# Altium schematic sheet adapter.SchDoc
size A3; SheetNumber: 1; SheetTotal: 1
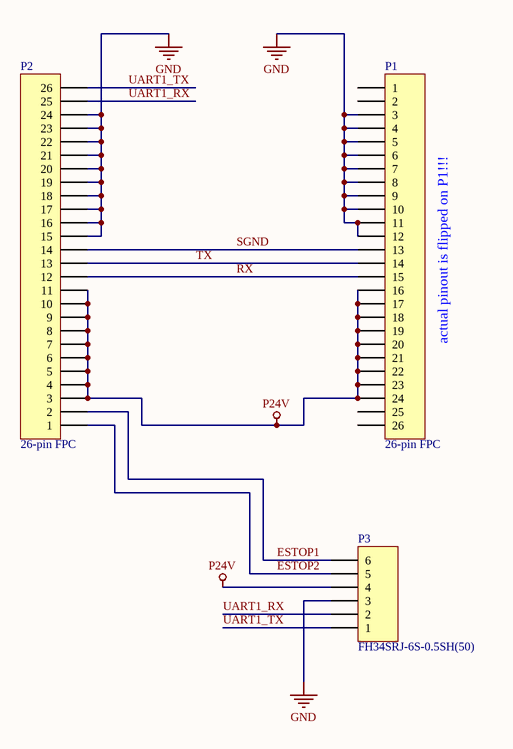
[diagram p0: adapter.SchDoc]

## Parts
P1  26-pin FPC  [HRS_FH34SRJ-26S-0.5SH(50)]
P2  26-pin FPC  [HRS_FH34SRJ-26S-0.5SH(50)]
P3  FH34SRJ-6S-0.5SH(50)  [HRS_FH34SRJ-6S-0.5SH(50)]

## Nets
GND: P1.3 P1.4 P1.5 P1.6 P1.7 P1.8 P1.9 P1.10 P1.11 P1.12 P2.15 P2.16 P2.17 P2.18 P2.19 P2.20 P2.21 P2.22 P2.23 P2.24 P3.3
P24V: P1.16 P1.17 P1.18 P1.19 P1.20 P1.21 P1.22 P1.23 P1.24 P2.3 P2.4 P2.5 P2.6 P2.7 P2.8 P2.9 P2.10 P2.11 P3.4
ESTOP1: P2.2 P3.6
ESTOP2: P2.1 P3.5
RX: P1.15 P2.12
SGND: P1.13 P2.14
TX: P1.14 P2.13
UART1_RX: P2.25 P3.2
UART1_TX: P2.26 P3.1

Not connected (* = marked no-connect by the designer): P1 1 2 25 26

## Notes on the sheet
- (near P1) actual pinout is flipped on P1!!!

## Library data of the parts
P1 P2 = FPC-26: 26 Pin FPC header; MPN: FH34SRJ-26S-0.5SH(99); MYPN: J-FPC-0.5mm-26-0.3mm-T/B; VENDOR: Hirose; System: Connector
P3 = Header 6: Header, 6-Pin; MYPN: J-FH34SRJ-6S-0.5SH(50); VENDOR: HRS; LatestRevisionDate: 17-Jul-2002; LatestRevisionNote: Re-released for DXP Platform.; Publisher: Altium Limited; MPN: FH34SRJ-6S-0.5SH(50)